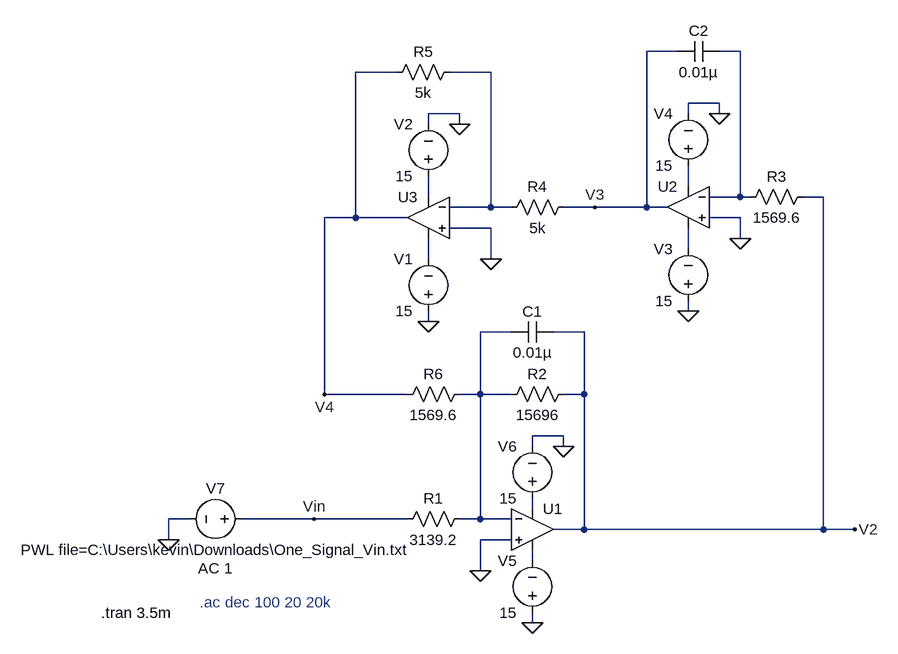
[diagram p0: schematic FilterVerification.asc]
FilterVerification.asc, the LTspice schematic file:
Version 4.1
SHEET 1 1620 680
WIRE 624 -416 576 -416
WIRE 720 -416 688 -416
WIRE 192 -384 128 -384
WIRE 336 -384 272 -384
WIRE 688 -336 640 -336
WIRE 288 -320 240 -320
WIRE 640 -320 640 -336
WIRE 688 -320 688 -336
WIRE 240 -304 240 -320
WIRE 288 -304 288 -320
WIRE 640 -208 640 -240
WIRE 240 -192 240 -224
WIRE 720 -192 720 -416
WIRE 720 -192 672 -192
WIRE 736 -192 720 -192
WIRE 848 -192 816 -192
WIRE 336 -176 336 -384
WIRE 336 -176 272 -176
WIRE 368 -176 336 -176
WIRE 496 -176 448 -176
WIRE 576 -176 576 -416
WIRE 576 -176 496 -176
WIRE 608 -176 576 -176
WIRE 128 -160 128 -384
WIRE 128 -160 80 -160
WIRE 208 -160 128 -160
WIRE 720 -160 672 -160
WIRE 336 -144 272 -144
WIRE 720 -128 720 -160
WIRE 640 -112 640 -144
WIRE 240 -96 240 -128
WIRE 336 -96 336 -144
WIRE 640 -16 640 -32
WIRE 240 0 240 -16
WIRE 368 16 320 16
WIRE 480 16 432 16
WIRE 80 112 80 -160
WIRE 208 112 80 112
WIRE 320 112 320 16
WIRE 320 112 288 112
WIRE 368 112 320 112
WIRE 480 112 480 16
WIRE 480 112 448 112
WIRE 448 176 400 176
WIRE 400 192 400 176
WIRE 448 192 448 176
WIRE 400 288 400 272
WIRE -128 304 -160 304
WIRE 64 304 -48 304
WIRE 208 304 64 304
WIRE 320 304 320 112
WIRE 320 304 288 304
WIRE 368 304 320 304
WIRE 480 320 480 112
WIRE 480 320 432 320
WIRE 848 320 848 -192
WIRE 848 320 480 320
WIRE 896 320 848 320
WIRE -160 336 -160 304
WIRE 368 336 320 336
WIRE 400 368 400 352
WIRE 320 384 320 336
WIRE 400 464 400 448
FLAG 320 384 0
FLAG 336 -96 0
FLAG 896 320 V2
FLAG 496 -176 V3
FLAG 64 304 Vin
FLAG 240 0 0
FLAG 688 -320 0
FLAG 640 -16 0
FLAG 448 192 0
FLAG 400 464 0
FLAG 80 112 V4
FLAG 720 -128 0
FLAG 288 -304 0
FLAG -160 336 0
SYMBOL res 304 288 R90
WINDOW 0 0 56 VBottom 2
WINDOW 3 32 56 VTop 2
SYMATTR InstName R1
SYMATTR Value 3139.2
SYMBOL res 832 -208 R90
WINDOW 0 0 56 VBottom 2
WINDOW 3 32 56 VTop 2
SYMATTR InstName R3
SYMATTR Value 1569.6
SYMBOL res 464 -192 R90
WINDOW 0 0 56 VBottom 2
WINDOW 3 32 56 VTop 2
SYMATTR InstName R4
SYMATTR Value 5k
SYMBOL voltage 240 0 R180
WINDOW 0 24 96 Left 2
WINDOW 3 24 16 Left 2
SYMATTR InstName V1
SYMATTR Value 15
SYMBOL res 288 -400 R90
WINDOW 0 0 56 VBottom 2
WINDOW 3 32 56 VTop 2
SYMATTR InstName R5
SYMATTR Value 5k
SYMBOL voltage 640 -16 R180
WINDOW 0 24 96 Left 2
WINDOW 3 24 16 Left 2
SYMATTR InstName V3
SYMATTR Value 15
SYMBOL voltage 640 -224 R180
WINDOW 0 24 96 Left 2
WINDOW 3 24 16 Left 2
SYMATTR InstName V4
SYMATTR Value 15
SYMBOL voltage 400 464 R180
WINDOW 0 24 96 Left 2
WINDOW 3 24 16 Left 2
SYMATTR InstName V5
SYMATTR Value 15
SYMBOL voltage 400 288 R180
WINDOW 0 24 96 Left 2
WINDOW 3 24 16 Left 2
SYMATTR InstName V6
SYMATTR Value 15
SYMBOL res 464 96 R90
WINDOW 0 0 56 VBottom 2
WINDOW 3 32 56 VTop 2
SYMATTR InstName R2
SYMATTR Value 15696
SYMBOL cap 432 0 R90
WINDOW 0 0 32 VBottom 2
WINDOW 3 32 32 VTop 2
SYMATTR InstName C1
SYMATTR Value 0.01µ
SYMBOL cap 688 -432 R90
WINDOW 0 0 32 VBottom 2
WINDOW 3 32 32 VTop 2
SYMATTR InstName C2
SYMATTR Value 0.01µ
SYMBOL res 304 96 R90
WINDOW 0 0 56 VBottom 2
WINDOW 3 32 56 VTop 2
SYMATTR InstName R6
SYMATTR Value 1569.6
SYMBOL voltage 240 -208 R180
WINDOW 0 24 96 Left 2
WINDOW 3 24 16 Left 2
SYMATTR InstName V2
SYMATTR Value 15
SYMBOL voltage -32 304 R90
WINDOW 0 -32 56 VBottom 2
WINDOW 3 32 56 VTop 2
WINDOW 123 60 56 VTop 2
WINDOW 39 0 0 Left 0
SYMATTR InstName V7
SYMATTR Value PWL file=C:\Users\kevin\Downloads\One_Signal_Vin.txt
SYMATTR Value2 AC 1
SYMBOL OpAmps\\UniversalOpAmp2 400 320 R0
SYMATTR InstName U1
SYMBOL OpAmps\\UniversalOpAmp2 640 -176 M0
SYMATTR InstName U2
SYMBOL OpAmps\\UniversalOpAmp2 240 -160 M0
SYMATTR InstName U3
TEXT -112 432 Left 2 ;.ac dec 100 20 20k
TEXT -264 448 Left 2 !.tran 3.5m

The netlist it stands for:
* FilterVerification.asc
R1 N007 Vin 3139.2
R3 V2 N001 1569.6
R4 V3 N002 5k
V1 0 N006 15
R5 N002 V4 5k
V3 0 N005 15
V4 N003 0 15
V5 0 N009 15
V6 N008 0 15
R2 V2 N007 15696
C1 V2 N007 0.01µ
C2 N001 V3 0.01µ
R6 N007 V4 1569.6
V2 N004 0 15
V7 Vin 0 PWL file=C:\Users\kevin\Downloads\One_Signal_Vin.txt AC 1
X§U1 0 N007 N008 N009 V2 level2 Avol=1Meg GBW=10Meg Slew=10Meg Ilimit=25m Rail=0 Vos=0 En=0 Enk=0 In=0 Ink=0 Rin=500Meg  ; pins In+ In- V+ V- OUT
X§U2 0 N001 N003 N005 V3 level2 Avol=1Meg GBW=10Meg Slew=10Meg Ilimit=25m Rail=0 Vos=0 En=0 Enk=0 In=0 Ink=0 Rin=500Meg  ; pins In+ In- V+ V- OUT
X§U3 0 N002 N004 N006 V4 level2 Avol=1Meg GBW=10Meg Slew=10Meg Ilimit=25m Rail=0 Vos=0 En=0 Enk=0 In=0 Ink=0 Rin=500Meg  ; pins In+ In- V+ V- OUT
* .ac dec 100 20 20k
.tran 3.5m
.lib UniversalOpAmp2.lib
.backanno
.end